# EAGLE design Ethernet_Mini_Shield_v0.1 (EAGLE 7.6.0)
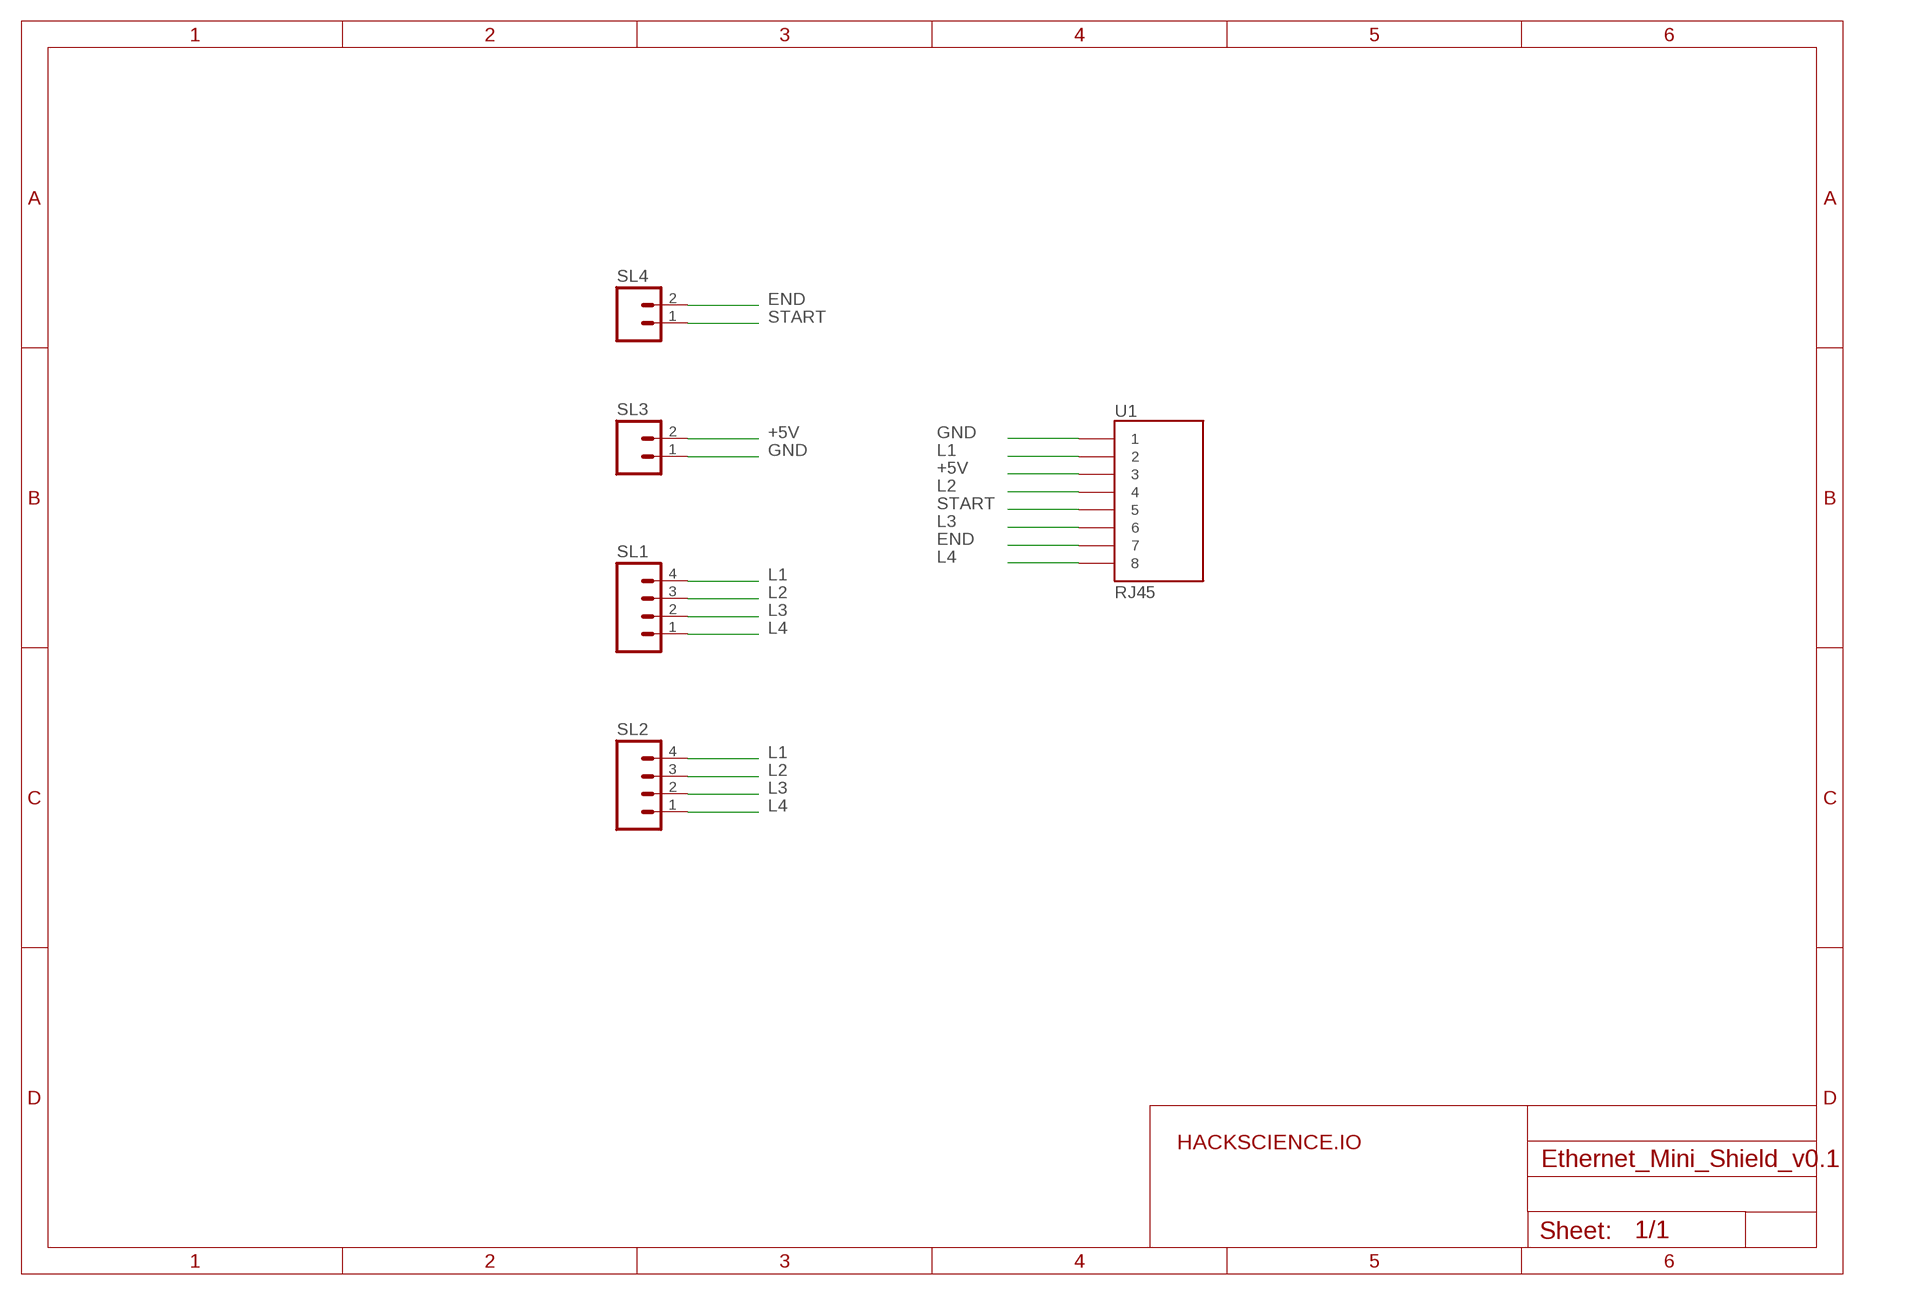
[diagram p0: schematic, sheet 1]

## Parts
SL1  M04  [04P]
SL2  M04  [04P]
SL3  M02  [02P]
SL4  M02  [02P]
U1  RJ45  RJ45-8PTH  [RJ45-8]

## Nets
+5V: SL3.2 U1.3
END: SL4.2 U1.7
GND: SL3.1 U1.1
L1: SL1.4 SL2.4 U1.2
L2: SL1.3 SL2.3 U1.4
L3: SL1.2 SL2.2 U1.6
L4: SL1.1 SL2.1 U1.8
START: SL4.1 U1.5

## Notes on the sheet
- HACKSCIENCE.IO

## Library data of the parts
SL1 SL2 = con-amp-quick:M04: AMP QUICK CONNECTOR; OC_FARNELL: unknown; OC_NEWARK: unknown
SL3 SL4 = con-amp-quick:M02: AMP QUICK CONNECTOR; OC_FARNELL: unknown; OC_NEWARK: unknown
U1 = SparkFun:RJ45-8: RJ45 Jack Simple RJ45, 8-pin connection - connector for common Cat5, Cat5e, and Cat6 Ethernet cables. Footprint not yet proven in production. Connector sku is PRT-00643; Breakout PCB sku is BOB-00716.

## Board
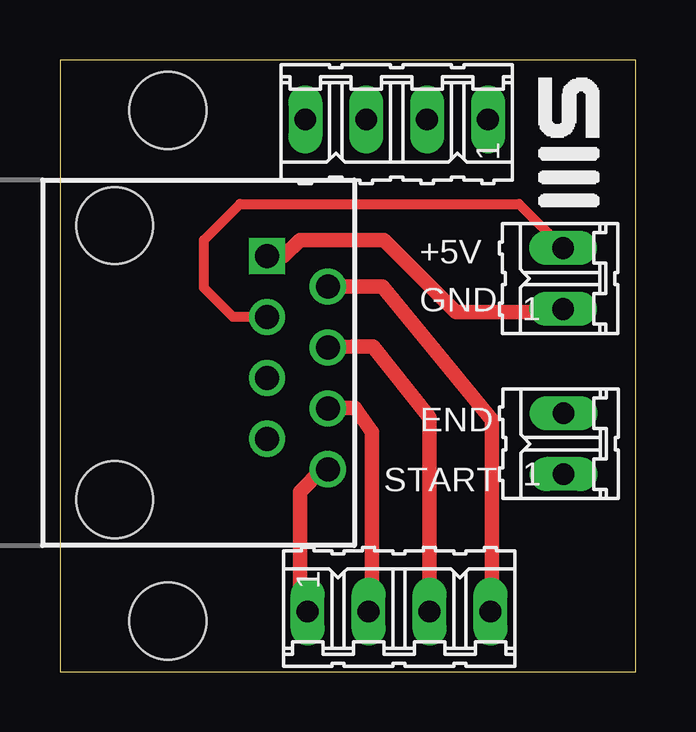
[diagram p1: board, top side]
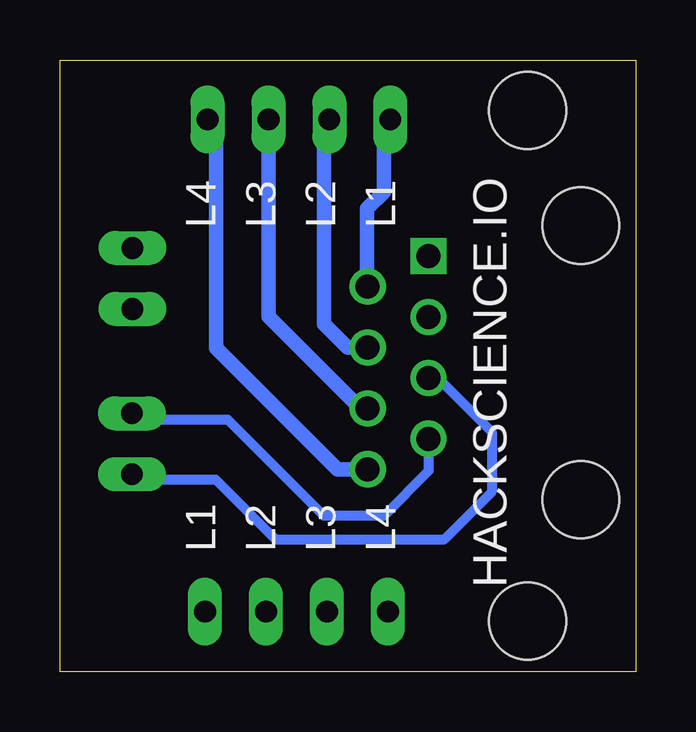
[diagram p2: board, bottom side, seen from below]

Size 24 x 25.5 mm. Coordinates in mm from the lower left corner, seen from the top.
Outline: 0,0 24,0 24,25.5 0,25.5 0,0
Copper layers (1*16): Top 0.035mm / dielectric 1.5mm / Bottom 0.035mm
Design rules "default": minimum track width 10mil, minimum drill 24mil, track to track 8mil, track to pad 8mil, pad to pad 8mil, via to via 8mil, smd to smd 8mil, copper to edge 40mil, drill to drill 8mil, minimum pad ring 10mil, minimum via ring 8mil, stop-mask expansion 4mil, vias tented up to drill 0mil, thermal gap 10mil
Holes 3.2 mm at 4.5,23.4 4.5,2.1

### Footprints (pad centres in the part's own frame; a part is rotated, then mirrored left to right if it is on the bottom)
04P = drill 0.914 long: 1 -3.81,0; 2 -1.27,0; 3 1.27,0; 4 3.81,0
02P = drill 0.914 long: 1 -1.27,0; 2 1.27,0
RJ45-8 = drill 1 square: 1 -4.445,6.35 | drill 1: 2 -3.175,8.89; 3 -1.905,6.35; 4 -0.635,8.89; 5 0.635,6.35; 6 1.905,8.89; 7 3.175,6.35; 8 4.445,8.89 | hole 3.2: -5.715,0; 5.715,0

### Placement (x,y rotation side)
SL1  14.04,23.02 180 top
SL2  14.14,2.5 0 top
SL3  20.98,16.39 90 top
SL4  21,9.5 90 top
U1  2.28,12.88 270 top

### Tracks (layer width: path | path; a pad name or v marks a point on that pad's centre or on a via)
+5V
  Top 0.406: U1.3 7.21,14.79 6,16 6,18 7.5,19.5 19.14,19.5 SL3.2
END
  Bottom 0.406: U1.7 8.63,8.37 10.5,6.5 13,6.5 17,10.5 20.73,10.5 SL4.2
GND
  Top 0.406: U1.1 9.32,17.32 | 20.86,15 SL3.1
  Top 0.61: 9.32,17.32 10,18 13.5,18 16.5,15 20.86,15
L1
  Top 0.61: U1.2 13.45,16.05 18,10.5 18,2.55 SL2.4
  Bottom 0.61: U1.2 11.2,16.05 11.2,19.3 10.5,20 10.5,22.75 SL1.4
L2
  Top 0.61: SL2.3 15.41,10.59 13.05,13.55 12.21,13.55 U1.4
  Bottom 0.61: U1.4 12.02,13.52 13,14.5 13,22.79 SL1.3
L3
  Top 0.61: SL2.2 13,2.63 13,10 12.3,11 11.2,11 U1.6
  Bottom 0.61: SL1.2 15.31,14.81 12.5,12 11.49,11 U1.6
L4
  Top 0.61: U1.8 10.94,8.44 10,7.5 10,2.83 SL2.1
  Bottom 0.61: U1.8 12.44,8.44 17.5,13.5 17.5,22.67 SL1.1
START
  Bottom 0.406: U1.5 8.24,12.24 6,10 6,7.5 8,5.5 15,5.5 17.5,8 20.77,8 SL4.1

### Text on the board
tPlace: +5V | GND | END | START
bPlace: HACKSCIENCE.IO | L1 | L2 | L3 | L4 | L4 | L3 | L2 | L1